# Altium schematic sheet Pi_SD_CARD.SchDoc: =DocumentName
size B; DrawnBy: Cary Smith; Organization: Las Cumbres Observatoy; Address1: 6740 Cortona Dr.; Address2: Suite 102; Address3: Goleta, CA 93117; DocumentNumber: 1; Revision: 1; SheetNumber: 1; SheetTotal: 1000's
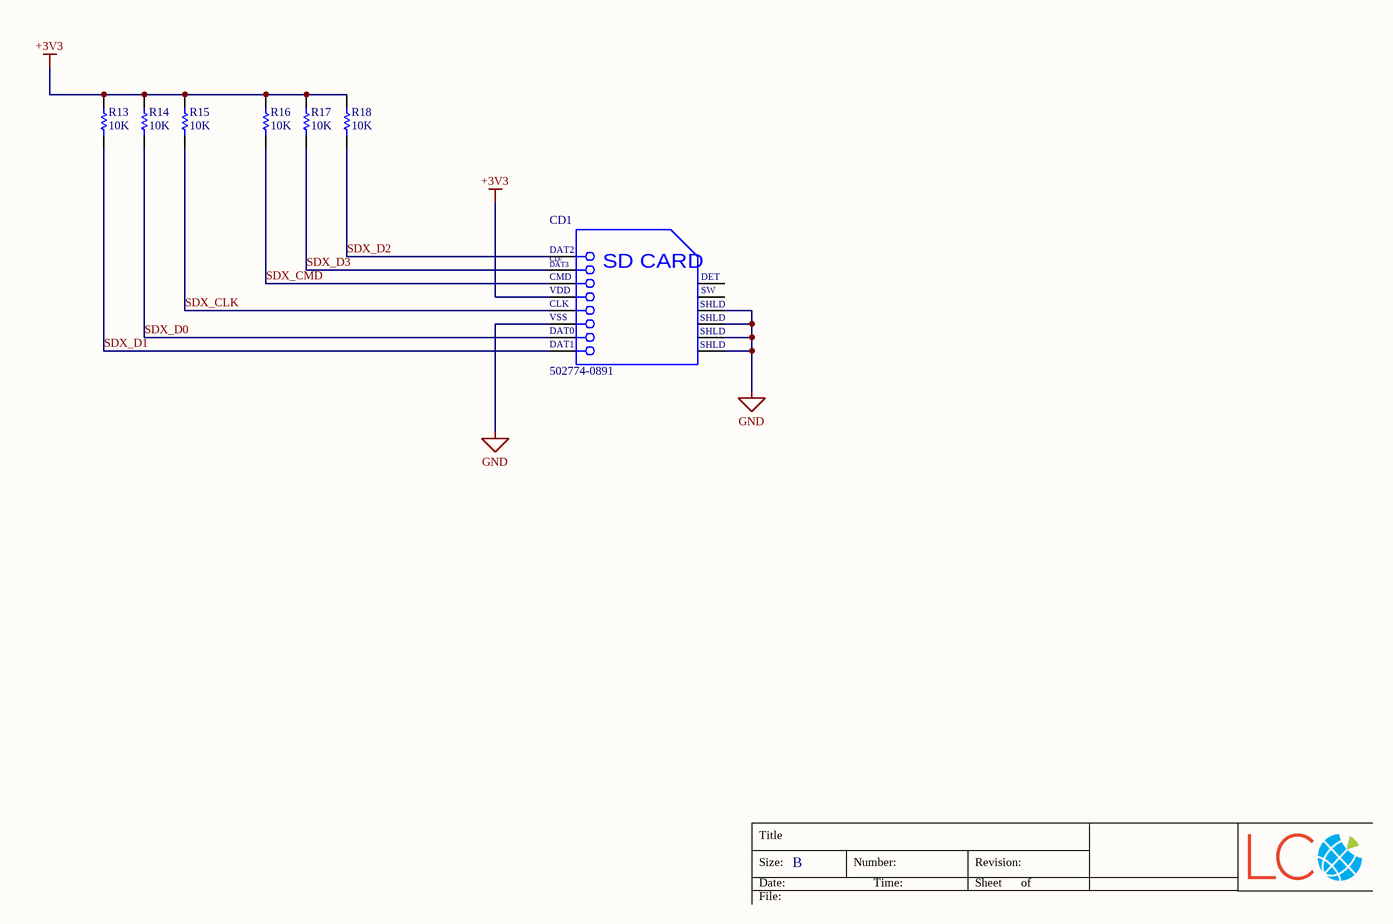
[diagram p0: Pi_SD_CARD.SchDoc]

## Parts
CD1  502774-0891  [MOLX-502774-0891_V]
R13  10K  [RESC1005X40X25NL05T05]
R14  10K  [RESC1005X40X25NL05T05]
R15  10K  [RESC1005X40X25NL05T05]
R16  10K  [RESC1005X40X25NL05T05]
R17  10K  [RESC1005X40X25NL05T05]
R18  10K  [RESC1005X40X25NL05T05]

## Nets
+3V3: CD1.4(VDD) R13.2 R14.2 R15.2 R16.2 R17.2 R18.2
GND: CD1.6(VSS) CD1.11(SHLD) CD1.12(SHLD) CD1.13(SHLD) CD1.14(SHLD)
SDX_CLK: CD1.5(CLK) R15.1
SDX_CMD: CD1.3(CMD) R16.1
SDX_D0: CD1.7(DAT0) R14.1
SDX_D1: CD1.8(DAT1) R13.1
SDX_D2: CD1.1(DAT2) R18.1
SDX_D3: CD1.2(CD/DAT3) R17.1

Not connected (* = marked no-connect by the designer): CD1 9(DETECT) 10(SWITCH)

## Notes on the sheet
- Title
- Size:
- Date:
- B
- Number:
- Time:
- Revision:
- Sheet
- of
- File:
- (in symbol CMP-2000-05248-1) CD/; DAT3; SD CARD; DET; SW

## Library data of the parts
CD1 = CMP-2000-05248-1: Micro SD Memory Card Connector, 0.5 A, 10 V (DC), -25 to 85 degC, 8-Pin SMT, RoHS, Tape and Reel; Manufacturer: Molex; 3D Model: 502774-0891.stp; Online Catalog: microSD™Series; Number of Positions: 10(8+2); Card Type: SecureDigital-microSD™; Insertion, Removal Method: PushIn,PushOut; Other Names: WM24066DKR; Connector Type: ConnectorandEjector; Features: Switch; Family: MemoryConnectors-PCCardSockets; Manufacturer URL: http://www.molex.com/; Mounting Type: SurfaceMount,RightAngle; Contact Finish Thickness: 20µin(0.51µm); Standard Package: 1; Series: 502774; Ejector Side: -; Datasheet Version: Rev. D, 04/2004; Category: Connectors,Interconnects; Contact Finish: Gold; Datasheet URL: https://datasheet.ciiva.com/1104/1499551-1104671.pdf; RoHS Information: 502774-0891CertofCompliance; Mounting Feature: Reverse-Bottom; Packaging: Digi-Reel; Catalog Drawings: 502774-0891
R13-R18 = CMP-2002-08135-1: CRCW040210K0FKED; Manufacturer: Vishay Dale; Part Number: CRCW040210K0FKED